# EAGLE design pcb_middle (EAGLE 9.6.2)
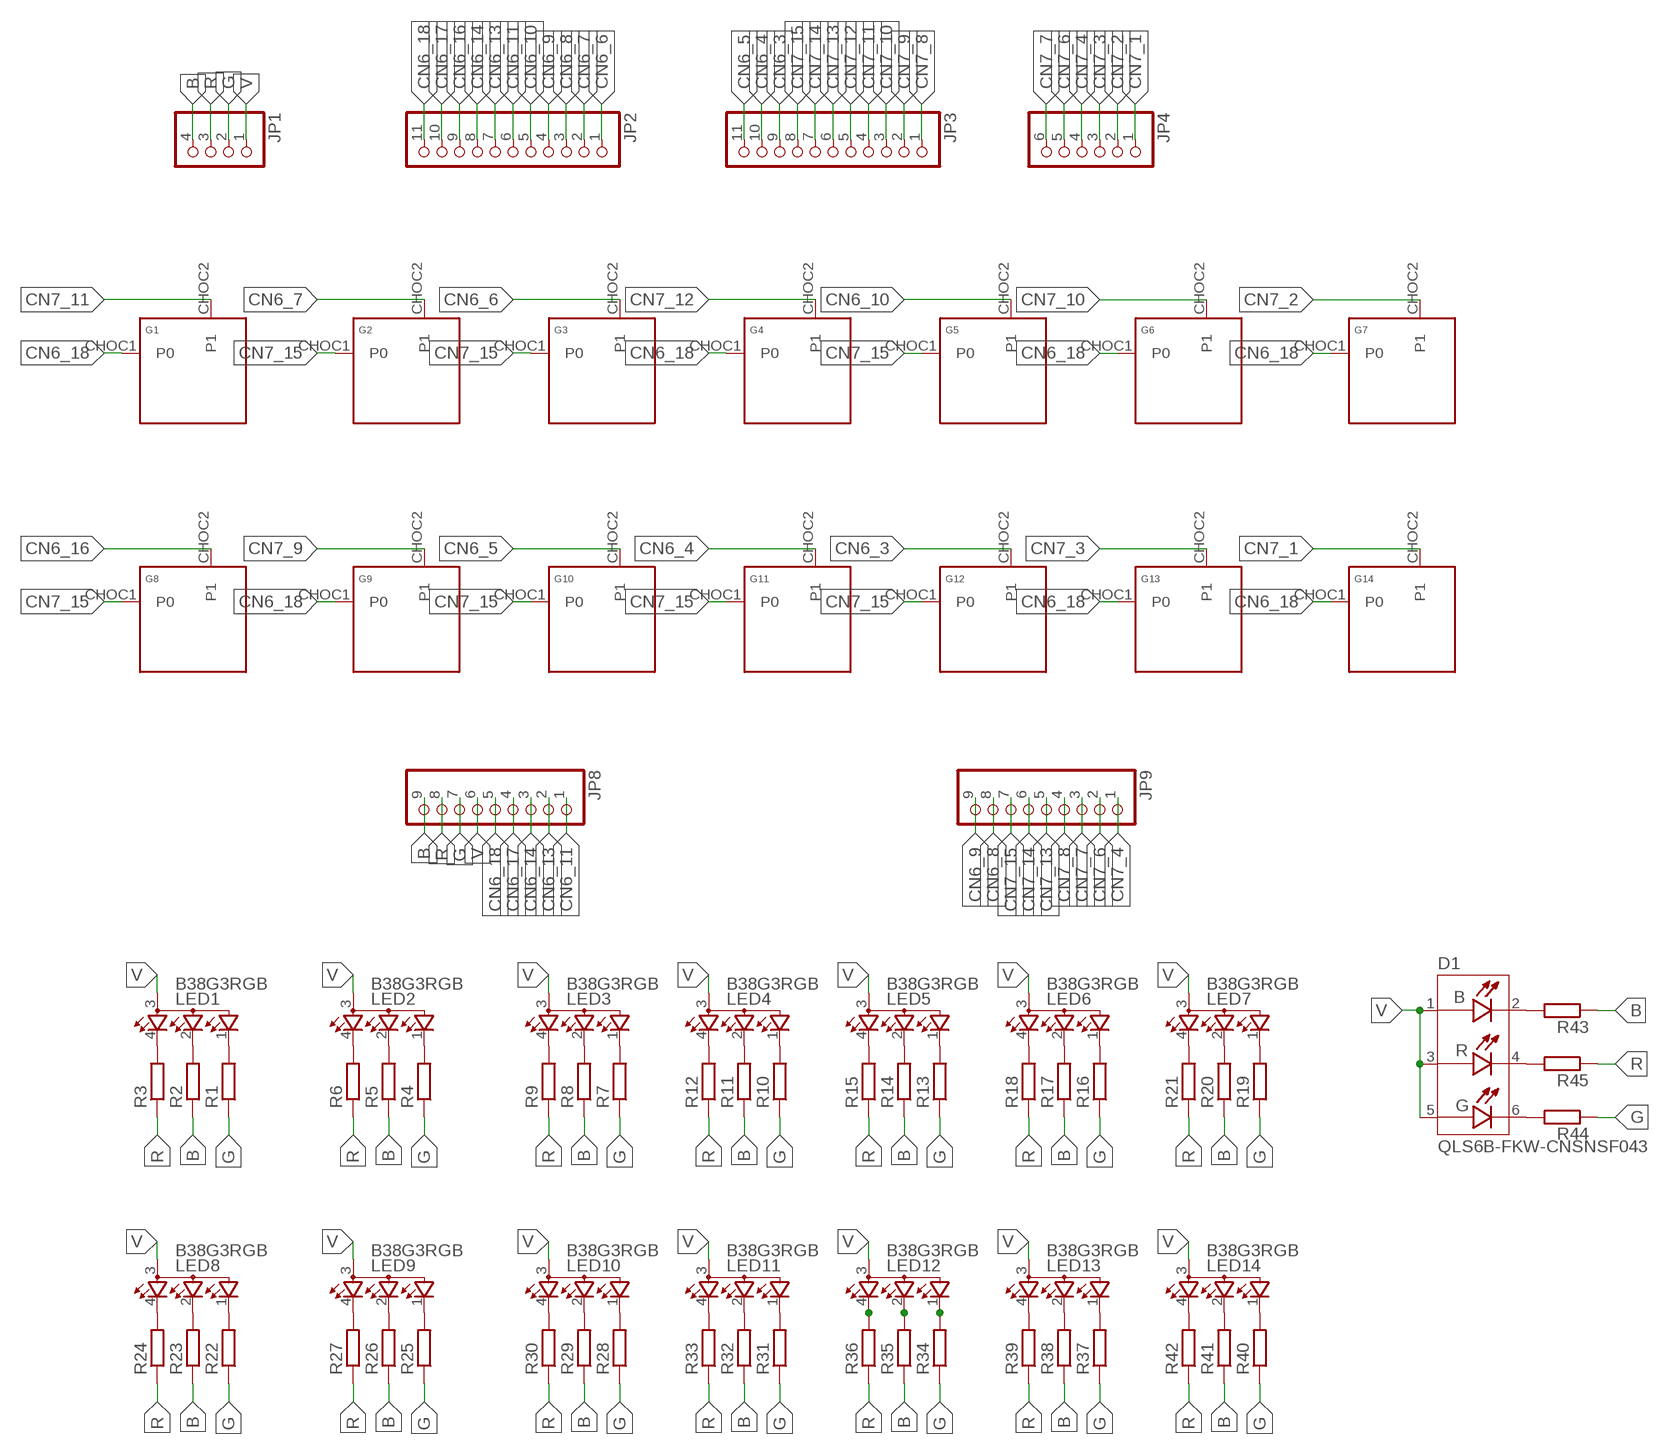
[diagram p0: schematic, sheet 1]

## Parts
D1  QLS6B-FKW-CNSNSF043  [LED_QLS6B-FKW-CNSNSF043]
G1  KEYSWITCH-PLAIN-CHOC-1U  [CHOC-1U]
G2  KEYSWITCH-PLAIN-CHOC-1U  [CHOC-1U]
G3  KEYSWITCH-PLAIN-CHOC-1U  [CHOC-1U]
G4  KEYSWITCH-PLAIN-CHOC-1U  [CHOC-1U]
G5  KEYSWITCH-PLAIN-CHOC-1U  [CHOC-1U]
G6  KEYSWITCH-PLAIN-CHOC-1U  [CHOC-1U]
G7  KEYSWITCH-PLAIN-CHOC-1U  [CHOC-1U]
G8  KEYSWITCH-PLAIN-CHOC-1U  [CHOC-1U]
G9  KEYSWITCH-PLAIN-CHOC-1U  [CHOC-1U]
G10  KEYSWITCH-PLAIN-CHOC-1U  [CHOC-1U]
G11  KEYSWITCH-PLAIN-CHOC-1U  [CHOC-1U]
G12  KEYSWITCH-PLAIN-CHOC-1U  [CHOC-1U]
G13  KEYSWITCH-PLAIN-CHOC-1U  [CHOC-1U]
G14  KEYSWITCH-PLAIN-CHOC-1U  [CHOC-1U]
JP1  THROUHOLE04  [THROUHOLE04]
JP2  THROUHOLE11  [THROUHOLE11]
JP3  THROUHOLE11  [THROUHOLE11]
JP4  THROUHOLE06  [THROUHOLE06]
JP8  THROUHOLE09  [THROUHOLE09]
JP9  THROUHOLE09  [THROUHOLE09]
LED1  B38G3RGB  [B38G3RGB]
LED2  B38G3RGB  [B38G3RGB]
LED3  B38G3RGB  [B38G3RGB]
LED4  B38G3RGB  [B38G3RGB]
LED5  B38G3RGB  [B38G3RGB]
LED6  B38G3RGB  [B38G3RGB]
LED7  B38G3RGB  [B38G3RGB]
LED8  B38G3RGB  [B38G3RGB]
LED9  B38G3RGB  [B38G3RGB]
LED10  B38G3RGB  [B38G3RGB]
LED11  B38G3RGB  [B38G3RGB]
LED12  B38G3RGB  [B38G3RGB]
LED13  B38G3RGB  [B38G3RGB]
LED14  B38G3RGB  [B38G3RGB]
R1  R-EU_R0603  [R0603]
R2  R-EU_R0603  [R0603]
R3  R-EU_R0603  [R0603]
R4  R-EU_R0603  [R0603]
R5  R-EU_R0603  [R0603]
R6  R-EU_R0603  [R0603]
R7  R-EU_R0603  [R0603]
R8  R-EU_R0603  [R0603]
R9  R-EU_R0603  [R0603]
R10  R-EU_R0603  [R0603]
R11  R-EU_R0603  [R0603]
R12  R-EU_R0603  [R0603]
R13  R-EU_R0603  [R0603]
R14  R-EU_R0603  [R0603]
R15  R-EU_R0603  [R0603]
R16  R-EU_R0603  [R0603]
R17  R-EU_R0603  [R0603]
R18  R-EU_R0603  [R0603]
R19  R-EU_R0603  [R0603]
R20  R-EU_R0603  [R0603]
R21  R-EU_R0603  [R0603]
R22  R-EU_R0603  [R0603]
R23  R-EU_R0603  [R0603]
R24  R-EU_R0603  [R0603]
R25  R-EU_R0603  [R0603]
R26  R-EU_R0603  [R0603]
R27  R-EU_R0603  [R0603]
R28  R-EU_R0603  [R0603]
R29  R-EU_R0603  [R0603]
R30  R-EU_R0603  [R0603]
R31  R-EU_R0603  [R0603]
R32  R-EU_R0603  [R0603]
R33  R-EU_R0603  [R0603]
R34  R-EU_R0603  [R0603]
R35  R-EU_R0603  [R0603]
R36  R-EU_R0603  [R0603]
R37  R-EU_R0603  [R0603]
R38  R-EU_R0603  [R0603]
R39  R-EU_R0603  [R0603]
R40  R-EU_R0603  [R0603]
R41  R-EU_R0603  [R0603]
R42  R-EU_R0603  [R0603]
R43  R-EU_R0603  [R0603]
R44  R-EU_R0603  [R0603]
R45  R-EU_R0603  [R0603]

## Nets
B: JP1.4 JP8.9 R2.1 R5.1 R8.1 R11.1 R14.1 R17.1 R20.1 R23.1 R26.1 R29.1 R32.1 R35.1 R38.1 R41.1 R43.1
CN6_3: G12.CHOC2(P1) JP3.9
CN6_4: G11.CHOC2(P1) JP3.10
CN6_5: G10.CHOC2(P1) JP3.11
CN6_6: G3.CHOC2(P1) JP2.1
CN6_7: G2.CHOC2(P1) JP2.2
CN6_8: JP2.3 JP9.8
CN6_9: JP2.4 JP9.9
CN6_10: G5.CHOC2(P1) JP2.5
CN6_11: JP2.6 JP8.1
CN6_13: JP2.7 JP8.2
CN6_14: JP2.8 JP8.3
CN6_16: G8.CHOC2(P1) JP2.9
CN6_17: JP2.10 JP8.4
CN6_18: G1.CHOC1(P0) G4.CHOC1(P0) G6.CHOC1(P0) G7.CHOC1(P0) G9.CHOC1(P0) G13.CHOC1(P0) G14.CHOC1(P0) JP2.11 JP8.5
CN7_1: G14.CHOC2(P1) JP4.1
CN7_2: G7.CHOC2(P1) JP4.2
CN7_3: G13.CHOC2(P1) JP4.3
CN7_4: JP4.4 JP9.1
CN7_6: JP4.5 JP9.2
CN7_7: JP4.6 JP9.3
CN7_8: JP3.1 JP9.4
CN7_9: G9.CHOC2(P1) JP3.2
CN7_10: G6.CHOC2(P1) JP3.3
CN7_11: G1.CHOC2(P1) JP3.4
CN7_12: G4.CHOC2(P1) JP3.5
CN7_13: JP3.6 JP9.5
CN7_14: JP3.7 JP9.6
CN7_15: G2.CHOC1(P0) G3.CHOC1(P0) G5.CHOC1(P0) G8.CHOC1(P0) G10.CHOC1(P0) G11.CHOC1(P0) G12.CHOC1(P0) JP3.8 JP9.7
G: JP1.2 JP8.7 R1.1 R4.1 R7.1 R10.1 R13.1 R16.1 R19.1 R22.1 R25.1 R28.1 R31.1 R34.1 R37.1 R40.1 R44.1
N$1: LED1.1(CGREEN) R1.2
N$2: LED1.2(CBLUE) R2.2
N$3: LED1.4(CRED) R3.2
N$4: LED2.1(CGREEN) R4.2
N$5: LED2.2(CBLUE) R5.2
N$6: LED2.4(CRED) R6.2
N$7: LED3.1(CGREEN) R7.2
N$8: LED3.2(CBLUE) R8.2
N$9: LED3.4(CRED) R9.2
N$10: LED4.1(CGREEN) R10.2
N$11: LED4.2(CBLUE) R11.2
N$12: LED4.4(CRED) R12.2
N$13: LED5.1(CGREEN) R13.2
N$14: LED5.2(CBLUE) R14.2
N$15: LED5.4(CRED) R15.2
N$16: LED6.1(CGREEN) R16.2
N$17: LED6.2(CBLUE) R17.2
N$18: LED6.4(CRED) R18.2
N$19: LED7.1(CGREEN) R19.2
N$20: LED7.2(CBLUE) R20.2
N$21: LED7.4(CRED) R21.2
N$22: LED8.1(CGREEN) R22.2
N$23: LED8.2(CBLUE) R23.2
N$24: LED8.4(CRED) R24.2
N$25: LED9.1(CGREEN) R25.2
N$26: LED9.2(CBLUE) R26.2
N$27: LED9.4(CRED) R27.2
N$28: LED10.1(CGREEN) R28.2
N$29: LED10.2(CBLUE) R29.2
N$30: LED10.4(CRED) R30.2
N$31: LED11.1(CGREEN) R31.2
N$32: LED11.2(CBLUE) R32.2
N$33: LED11.4(CRED) R33.2
N$34: LED12.1(CGREEN) R34.2
N$35: LED12.2(CBLUE) R35.2
N$36: LED12.4(CRED) R36.2
N$37: LED13.1(CGREEN) R37.2
N$38: LED13.2(CBLUE) R38.2
N$39: LED13.4(CRED) R39.2
N$40: LED14.1(CGREEN) R40.2
N$41: LED14.2(CBLUE) R41.2
N$42: LED14.4(CRED) R42.2
N$43: D1.2(BLUE_CATHODE) R43.2
N$44: D1.6(GREEN_CATHODE) R44.2
N$45: D1.4(RED_CATHODE) R45.2
R: JP1.3 JP8.8 R3.1 R6.1 R9.1 R12.1 R15.1 R18.1 R21.1 R24.1 R27.1 R30.1 R33.1 R36.1 R39.1 R42.1 R45.1
V: D1.1(BLUE_ANODE) D1.3(RED_ANODE) D1.5(GREEN_ANODE) JP1.1 JP8.6 LED1.3(A) LED2.3(A) LED3.3(A) LED4.3(A) LED5.3(A) LED6.3(A) LED7.3(A) LED8.3(A) LED9.3(A) LED10.3(A) LED11.3(A) LED12.3(A) LED13.3(A) LED14.3(A)

## Library data of the parts
D1 = QLS6B-FKW-CNSNSF043:QLS6B-FKW-CNSNSF043: Check prices <https://pricing.snapeda.com/parts/QLS6B-FKW-CNSNSF043/Cree%20Inc./view-part?ref=eda>; AVAILABILITY: In Stock; DESCRIPTION: Red, Green, Blue (RGB) 622nm Red, 530nm Green, 470nm Blue LED Indication - Discrete 2.1V Red, 3V Green, 3.1V Blue 6-SMD, J-Lead; MF: Cree Inc.; MP: QLS6B-FKW-CNSNSF043; PACKAGE: SMD-6 Cree; PRICE: None; PURCHASE-URL: https://pricing.snapeda.com/search/part/QLS6B-FKW-CNSNSF043/?ref=eda
G1-G14 = Keyboard:KEYSWITCH-PLAIN
JP1 = pinhead-half-pitch:THROUHOLE04
JP2 JP3 = pinhead-half-pitch:THROUHOLE11
JP4 = pinhead-half-pitch:THROUHOLE06
JP8 JP9 = pinhead-half-pitch:THROUHOLE09
LED1-LED14 = led_rgb:B38G3RGB: Chip LED RGB Source: http://document.sharpsma.com/files/GM1WA55311A_SS.pdf
R1-R45 = rcl:R-EU_: RESISTOR, European symbol; SPICEPREFIX: R

## Board
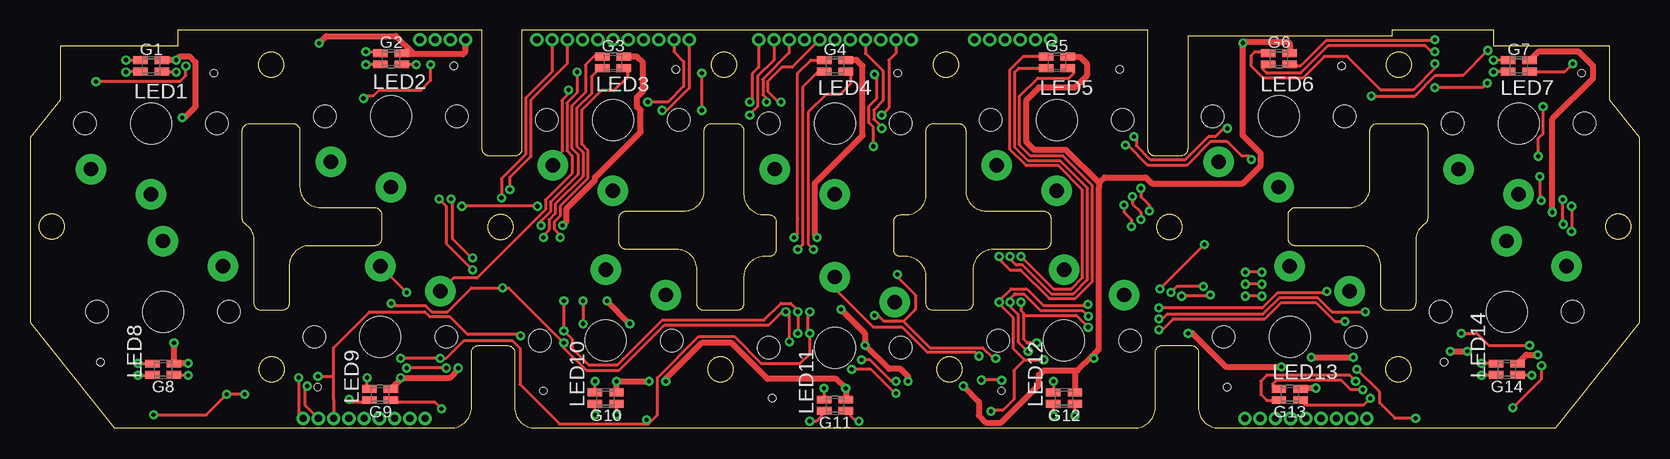
[diagram p1: board, top side]
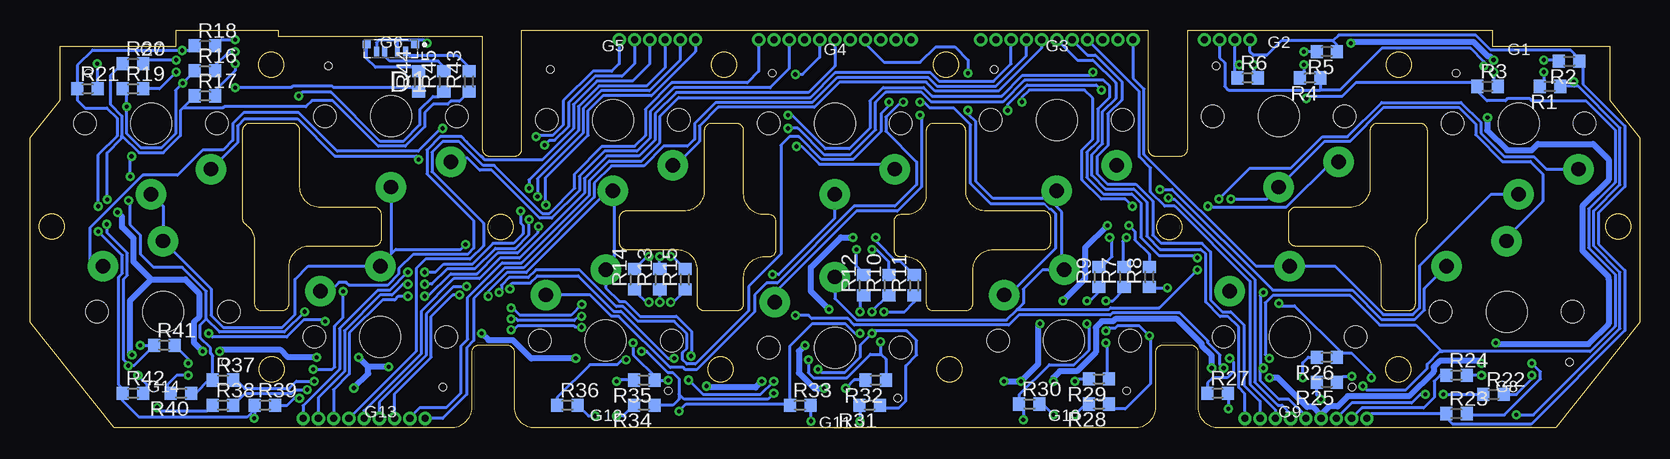
[diagram p2: board, bottom side, seen from below]

Size 134.2 x 33.2 mm. Coordinates in mm from the lower left corner, seen from the top.
Outline: 49.11,17.5 arc-90 49.71,18.1 54.5,18.1 arc90 56.2,19.8 56.2,24.8 arc-90 56.8,25.4 58.9,25.4 arc-90 59.5,24.8 59.5,19.5 arc90 61.2,17.8 61.6,17.8 arc-90 62.2,17.2 62.2,14.9 arc-90 61.6,14.3 61.2,14.3 arc90 59.5,12.6 59.5,10.4 arc-90 58.9,9.8 56.2,9.8 arc-90 55.6,10.4 55.6,13.2 arc90 53.9,14.9 49.71,14.9 arc-90 49.11,15.5 49.11,17.5
Outline: 80.3,14.9 arc90 78.6,13.2 78.6,10.4 arc-90 78,9.8 75.3,9.8 arc-90 74.7,10.4 74.7,12.6 arc90 73,14.3 72.6,14.3 arc-90 72,14.9 72,17.2 arc-90 72.6,17.8 73,17.8 arc90 74.7,19.5 74.7,24.8 arc-90 75.3,25.4 77.4,25.4 arc-90 78,24.8 78,19.8 arc90 79.7,18.1 84.49,18.1 arc-90 85.09,17.5 85.09,15.5 arc-90 84.49,14.9 80.3,14.9
Outline: 17.7,24.8 arc-90 18.3,25.4 21.9,25.4 arc-90 22.5,24.8 22.5,20.1 arc90 24.2,18.4 28.71,18.4 arc-90 29.31,17.8 29.31,15.8 arc-90 28.71,15.2 23.3,15.2 arc90 21.6,13.5 21.6,10.4 arc-90 21,9.8 19.3,9.8 arc-90 18.7,10.4 18.7,15.6 arc56 17.96,17 arc-56 17.7,17.5 17.7,24.8
Outline: 116.5,17.5 arc-56 116.24,17 arc56 115.5,15.6 115.5,10.4 arc-90 114.9,9.8 113.2,9.8 arc-90 112.6,10.4 112.6,13.5 arc90 110.9,15.2 105.49,15.2 arc-90 104.89,15.8 104.89,17.8 arc-90 105.49,18.4 110,18.4 arc90 111.7,20.1 111.7,24.8 arc-90 112.3,25.4 115.9,25.4 arc-90 116.5,24.8 116.5,17.5
Outline: 134.2,8.83 134.2,24.21 131.7,27.36 131.7,31.85 122,31.85 122,33.2 113.5,33.2 113.5,32.7 96.5,32.7 96.5,23.29 arc-90 95.9,22.69 93.8,22.69 arc-90 93.2,23.29 93.2,33.2 41,33.2 41,23.29 arc-90 40.4,22.69 38.3,22.69 arc-90 37.7,23.29 37.7,33.2 12.3,33.2 12.3,31.85 2.5,31.85 2.5,27.36 0,24.21 0,8.83 7.02,0 35.1,0 arc90 36.8,1.7 36.8,6.29 arc-90 37.4,6.89 39.8,6.89 arc-90 40.4,6.29 40.4,1.7 arc90 42.1,0 92.1,0 arc90 93.8,1.7 93.8,6.29 arc-90 94.4,6.89 96.8,6.89 arc-90 97.4,6.29 97.4,1.7 arc90 99.1,0 127.18,0 134.2,8.83
Outline: circle at 1.8,16.81 radius 1.05
Outline: circle at 20.1,30.3 radius 1.05
Outline: circle at 20.15,4.9 radius 1.05
Outline: circle at 39.21,16.79 radius 1.05
Outline: circle at 57.85,30.3 radius 1.05
Outline: circle at 57.55,4.9 radius 1.05
Outline: circle at 76.65,4.9 radius 1.05
Outline: circle at 76.35,30.3 radius 1.05
Outline: circle at 94.99,16.79 radius 1.05
Outline: circle at 114.05,4.9 radius 1.05
Outline: circle at 114.1,30.3 radius 1.05
Outline: circle at 132.4,16.81 radius 1.05
Copper layers (1*16): Top 0.035mm / dielectric 1.5mm / Bottom 0.035mm
Design rules "PCBGoGo": minimum track width 6mil, minimum drill 0.2mm, track to track 6mil, track to pad 6mil, pad to pad 6mil, via to via 6mil, smd to smd 6mil, copper to edge 0.2mm, drill to drill 6mil, minimum pad ring 10mil, minimum via ring 8mil, stop-mask expansion 4mil, vias tented up to drill 0mil, thermal gap 10mil

### Footprints (pad centres in the part's own frame; a part is rotated, then mirrored left to right if it is on the bottom)
LED_QLS6B-FKW-CNSNSF043 = smd 0.66 x 0.63: 1 -2.02,-0.185; 6 2.02,-0.185 | smd 0.4 x 0.8: 2 -1.21,0.4; 3 -0.53,0.4; 4 0.53,0.4; 5 1.21,0.4
CHOC-1U = drill 1.2 pad 2.54: CHOC1 0,5.9; CHOC2 5,3.8 | hole 3.4: 0,0 | hole 0.6: -5.22,-4.2 | hole 1.85: -5.5,0; 5.5,0
THROUHOLE04 = drill 0.6: 1 -1.905,0; 2 -0.635,0; 3 0.635,0; 4 1.905,0
THROUHOLE11 = drill 0.6: 1 -6.35,0; 2 -5.08,0; 3 -3.81,0; 4 -2.54,0; 5 -1.27,0; 6 0,0; 7 1.27,0; 8 2.54,0; 9 3.81,0; 10 5.08,0; 11 6.35,0
THROUHOLE06 = drill 0.6: 1 -3.175,0; 2 -1.905,0; 3 -0.635,0; 4 0.635,0; 5 1.905,0; 6 3.175,0
THROUHOLE09 = drill 0.6: 1 -5.08,0; 2 -3.81,0; 3 -2.54,0; 4 -1.27,0; 5 0,0; 6 1.27,0; 7 2.54,0; 8 3.81,0; 9 5.08,0
B38G3RGB = smd 0.65 x 1.2: 1 -0.475,0.9; 2 0.475,0.9; 3 0.475,-0.9; 4 -0.475,-0.9
R0603 = smd 1 x 1.1: 1 -0.85,0; 2 0.85,0

### Placement (x,y rotation side)
D1  104.1,31.8 180 bottom
G1  10.1,25.4 180 top
G2  30.1,26 180 top
G3  48.6,25.7 180 top
G4  67.1,25.4 180 top
G5  85.6,25.7 180 top
G6  104.1,26 180 top
G7  124.1,25.4 180 top
G8  11.1,9.7 0 top
G9  29.2,7.6 0 top
G10  48,7.3 0 top
G11  67.1,6.7 0 top
G12  86.2,7.3 0 top
G13  105,7.6 0 top
G14  123.1,9.7 0 top
JP1  34.4,32.4 180 top
JP2  48.6,32.4 180 top
JP3  67.1,32.4 180 top
JP4  81.9,32.4 180 top
JP8  27.85,0.8 180 top
JP9  106.35,0.8 180 top
LED1  10.1,30.2 90 top
LED2  30.1,30.8 90 top
LED3  48.6,30.5 90 top
LED4  67.1,30.2 90 top
LED5  85.6,30.5 90 top
LED6  104.1,30.8 90 top
LED7  124.1,30.2 90 top
LED8  11.1,4.9 90 top
LED9  29.2,2.8 90 top
LED10  48,2.5 90 top
LED11  67.1,1.9 90 top
LED12  86.2,2.5 90 top
LED13  105,2.8 90 top
LED14  123.1,4.9 90 top
R1  7.5,28.5 180 bottom
R2  5.9,30.6 180 bottom
R3  12.7,28.5 0 bottom
R4  27.5,29.2 180 bottom
R5  26.1,31.4 180 bottom
R6  32.7,29.2 0 bottom
R7  43,12.6 90 bottom
R8  40.9,12.6 90 bottom
R9  45.1,12.6 90 bottom
R10  62.6,11.9 90 bottom
R11  60.5,11.9 90 bottom
R12  64.7,11.9 90 bottom
R13  81.7,12.4 90 bottom
R14  83.8,12.4 90 bottom
R15  79.6,12.4 90 bottom
R16  119.6,29.8 0 bottom
R17  119.6,27.7 0 bottom
R18  119.6,31.9 0 bottom
R19  125.6,28.3 0 bottom
R20  125.6,30.4 0 bottom
R21  129.4,28.3 0 bottom
R22  12.2,2.8 0 bottom
R23  15.3,1.2 0 bottom
R24  15.3,4.4 0 bottom
R25  26.1,3.8 180 bottom
R26  26.1,5.9 180 bottom
R27  35.2,2.9 0 bottom
R28  45.1,2 180 bottom
R29  45.1,4.1 180 bottom
R30  50.9,2 0 bottom
R31  64.2,1.9 180 bottom
R32  63.7,4 180 bottom
R33  70,1.9 0 bottom
R34  83,1.9 180 bottom
R35  83,4 180 bottom
R36  89.4,1.9 0 bottom
R37  118.1,4 0 bottom
R38  118.1,1.9 0 bottom
R39  114.6,1.9 0 bottom
R40  121.6,2.9 180 bottom
R41  123,6.9 0 bottom
R42  125.6,2.9 0 bottom
R43  97.6,28.9 90 bottom
R44  101.8,28.9 90 bottom
R45  99.7,28.9 90 bottom

### Tracks (layer width: path | path; a pad name or v marks a point on that pad's centre or on a via)
B  (via drill 0.35)
  Top 0.254: v22.4,4.2 22.4,1.17 JP8.9 | v30.1,10.4 30.3,10.2 33,10.2 33.49,9.71 34.81,9.71 36.8,11.7 v39.4,11.7 39.9,11.7 v44.5,7.1 44.5,6.7 46.4,4.8 49.1,4.8 52.91,8.61 58.44,8.61 58.45,8.6 61.6,8.6 62.7,9.7 v63,9.7 63.3,9.4 v63.3,7.2 | v82.61,10.5 82.61,9.81 82.8,9.62 82.8,9.4 | v83.92,7.1 83.14,7.1 82.8,7.44 82.8,9.4 | v81,3.98 80.98,4 v79.3,4 | v72.2,3.9 71.8,3.9 70.01,5.69 v69.31,5.69 | v123.6,1.7 126,4.1 v126,5.2 | 82.8,9.4 87.22,9.4 v88.21,8.41 | v94.1,8.2 94.4,8.2 95.3,9.11 102.95,9.11 104.32,10.48 107.17,10.48 108.75,8.9 v109.6,8.9 | v127.8,17 127.77,17.03 v127.77,19.06 | v119.3,7.9 120.6,7.9 121.6,6.9 v125,6.9
  Bottom 0.254: JP8.9 22.37,1.2 16.2,1.2 | R23.1 16.2,1.2 | 16.2,1.2 16.2,0.93 15.6,0.33 9.07,0.33 1.25,8.14 1.25,13.16 3.45,15.36 3.45,17.94 1.25,20.14 1.25,25.2 4.75,28.7 4.75,30.3 R2.1 5.05,30.8 5.77,31.52 12.44,31.52 13.7,32.78 25.12,32.78 25.6,32.3 | v22.4,4.2 22.4,4.6 24.05,6.25 24.85,6.25 | R8.1 40.85,11.7 v39.4,11.7 | v44.5,7.1 44.45,7.05 44.45,4.3 R29.1 | v30.1,10.4 29.9,10.2 28.8,10.2 24.85,6.25 | R26.1 24.9,6.25 24.85,6.25 | 25.6,32.3 29.9,32.3 31.1,31.1 32.2,31.1 32.5,31.4 JP1.4 | R5.1 25.22,31.43 25.22,31.93 25.6,32.3 | v63.3,7.2 63.3,6.2 63.25,6.15 | 63.25,6.15 62.85,5.75 R32.1 | v63,9.7 61.3,9.7 60.5,10.5 R11.1 | R14.1 83.8,11.45 82.73,10.38 v82.61,10.5 | v83.92,7.1 83.92,6.12 81.97,4.18 R35.1 82.13,3.98 v81,3.98 | v69.31,5.69 69.31,4.61 68.9,4.2 66.1,4.2 64.15,6.15 63.25,6.15 | v79.3,4 78.11,2.81 73.29,2.81 v72.2,3.9 | R38.1 119.45,1.4 123.3,1.4 v123.6,1.7 | v88.21,8.41 88.71,8.41 88.85,8.55 93.52,8.55 93.87,8.2 v94.1,8.2 | R17.1 121.42,26.73 | 121.42,26.73 121.67,26.48 121.67,24.39 123.09,22.97 125.11,22.97 126.53,24.39 | R20.1 126.5,30.4 127.5,29.4 127.5,27 126.53,26.03 126.53,24.39 | v127.8,17 127.8,16.3 126.09,14.59 126.09,12.73 126.39,12.43 126.39,5.69 126,5.3 v126,5.2 125.55,5.2 R41.1 v125,6.9 | v127.77,19.06 127.77,22.95 126.53,24.19 126.53,24.39 | 121.42,26.73 121.4,26.7 118.1,26.7 118,26.8 111.2,26.8 110.69,27.31 108.99,27.31 105.17,23.5 102.92,23.5 | v109.6,8.9 109.7,9 111.4,9 112.8,7.6 119,7.6 v119.3,7.9 | R43.1 98.4,27.25 99.12,27.25 99.37,27 100.59,27 101.29,26.3 101.29,25.13 102.92,23.5 | 102.9,23.5 102.92,23.5
CN6_3  (via drill 0.35)
  Top 0.254: v61.4,27.2 61.4,27.51 61.09,27.81 61.09,29.1 63.29,31.3 JP3.9
  Bottom 0.254: v61.4,27.2 61.6,27.2 62.85,25.95 62.85,24.75 60.3,22.2 60.3,20.3 62.1,18.5 65.5,18.5 71.9,12.1 72.8,12.1 73.8,11.1 73.8,9.7 78.62,4.87 79.59,4.87 79.76,5.04 80.84,5.04 85.13,9.33 85.73,9.33 87.5,11.1 G12.CHOC2
CN6_4  (via drill 0.35)
  Top 0.254: v60,26.1 60,26.17 60.66,26.83 60.66,29.34 62.02,30.7 JP3.10
  Bottom 0.254: G11.CHOC2 72.1,11.3 65.31,18.09 61.91,18.09 59.89,20.11 59.89,25.99 v60,26.1
CN6_5  (via drill 0.35)
  Top 0.254: JP3.11 60.75,30.1 60.2,29.55 60.2,27.4 v60,27.2
  Bottom 0.203: 49.7,18.7 49.65,18.7 49.23,18.28 49.1,18.28 49.08,18.25
  Bottom 0.254: G10.CHOC2 52.7,11.4 52.3,11.4 48.7,15 48.7,17.88 49.08,18.25 | v60,27.2 59.7,27.2 59.2,26.7 57.2,26.7 55.8,25.3 55.8,20.4 54.1,18.7 49.7,18.7
CN6_6  (via drill 0.35)
  Top 0.254: JP2.1 54.95,28.35 53.1,26.5 v52.7,26.5 | G3.CHOC2 43.6,22.3 44.35,23.05 44.35,27.35 44.8,27.8 44.8,28.1 v44.9,28.2
  Bottom 0.254: v52.7,26.5 52.7,27 51.09,28.61 45.31,28.61 v44.9,28.2
CN6_7  (via drill 0.35)
  Top 0.254: v42.3,18.5 v36,18.5 | JP2.2 53.68,31.4 54.5,30.58 54.5,28.5 53.2,27.2 v51.5,27.2
  Bottom 0.254: G2.CHOC2 25.7,22.2 29.5,18.4 35.9,18.4 v36,18.5 | v51.5,27.2 51.5,27.6 50.9,28.2 46.3,28.2 45.6,27.5 45.6,24.1 46.51,23.19 46.51,20.71 44.9,19.1 42.9,19.1 v42.3,18.5
CN6_8
  Bottom 0.254: JP2.3 52.41,30.39 53.88,28.92 58.42,28.92 59.17,29.67 67.05,29.67 69.14,27.58 80.12,27.58 81.68,26.02 81.68,23.82 83.22,22.28 85.92,22.28 87.57,20.63 87.57,19.43 93.23,13.77 94.83,13.77 97.7,10.9 97.7,7.4 98.3,6.8 98.3,2.9 99.5,1.7 101.7,1.7 102.54,0.86 JP9.8
CN6_9
  Bottom 0.254: JP2.4 51.14,31.06 53.69,28.51 58.59,28.51 59.34,29.26 66.89,29.26 68.98,27.17 77.03,27.17 78.8,25.4 78.8,24.1 79.4,23.5 81.4,23.5 83.03,21.87 85.73,21.87 87.17,20.43 87.17,19.26 93.06,13.37 94.63,13.37 97.2,10.8 97.2,7.3 97.8,6.7 97.8,2.8 99.8,0.8 JP9.9
CN6_10
  Bottom 0.254: JP2.5 49.87,31.7 53.46,28.11 58.75,28.11 59.5,28.86 66.72,28.86 68.81,26.77 76.83,26.77 78.39,25.21 78.39,23.91 80.4,21.9 G5.CHOC2
CN6_11
  Bottom 0.254: JP8.1 32.93,2.86 33.45,3.38 33.45,8.42 34.33,9.3 35,9.3 36.2,10.5 36.2,14.5 36.6,14.9 40,14.9 41.1,16 41.1,18.85 42.19,19.94 44.54,19.94 45.69,21.09 45.69,22.81 44.79,23.71 44.79,26.4 43.7,27.49 43.7,28.8 45.6,30.7 46.9,30.7 JP2.6
CN6_13
  Bottom 0.254: JP8.2 31.66,2.24 33,3.58 33,8.6 34.11,9.71 34.81,9.71 35.79,10.69 35.79,14.69 36.5,15.4 39.9,15.4 40.6,16.1 40.6,18.92 42.03,20.35 44.38,20.35 45.25,21.22 45.25,22.65 44.35,23.55 44.35,26.22 43.2,27.37 43.2,28.9 45.41,31.11 46.04,31.11 JP2.7
CN6_14
  Bottom 0.254: JP8.3 30.39,1.54 32.51,3.66 32.51,12.23 38.77,18.5 39.6,18.5 40.8,19.7 40.8,21.7 41.73,22.63 41.73,28.07 JP2.8
CN6_16  (via drill 0.35)
  Top 0.254: v40,19.9 40,20.9 41.73,22.63 41.73,27.34 44.79,30.4 JP2.9
  Bottom 0.254: v40,19.9 39,19.9 30.6,11.5 23.99,11.5 21.56,9.07 18.74,9.07 17.97,9.84 17.97,11.63 G8.CHOC2
CN6_17  (via drill 0.35)
  Top 0.254: JP2.10 43.52,29.72 41.33,27.53 41.33,22.83 39.3,20.8 v39.3,19.2
  Bottom 0.254: v39.3,19.2 39.2,19.1 38.8,19.1 32.1,12.4 32.1,3.82 30.18,1.9 29.82,1.9 29.12,1.2 JP8.4
CN6_18  (via drill 0.35)
  Top 0.254: v72.3,12.8 72.3,12.6 73.8,11.1 73.8,9.9 72.8,8.9 | v31.4,11.3 G9.CHOC1 | v70.4,9.4 70.7,9.4 71.2,8.9 72.8,8.9 | v97.9,15.3 v94.2,11.6 | v34.7,5 v31.4,5 | 72.8,8.9 75,6.7 79.4,6.7 80.3,5.8 v80.5,5.8
  Bottom 0.254: JP2.11 42.25,29.2 41.33,28.28 41.33,22.83 32,13.5 G9.CHOC1 25.42,13.5 21.39,9.47 18.91,9.47 18.37,10.01 18.37,13.53 12.4,19.5 G1.CHOC1 | G7.CHOC1 123.1,18.5 G14.CHOC1 119.1,11.6 119.1,9.4 118.11,8.41 113.16,8.41 112.1,9.48 112.1,12.4 111,13.5 105.1,13.5 | 105.1,13.5 G13.CHOC1 105,13.6 103.7,14.9 98.3,14.9 v97.9,15.3 | G6.CHOC1 104.1,14.5 105.1,13.5 | v72.3,12.8 71.8,12.8 67.1,17.5 G4.CHOC1 | v94.2,11.6 94.2,11.9 94,12.1 92.5,12.1 91.9,12.7 88.5,12.7 85.53,9.73 84.93,9.73 81,5.8 v80.5,5.8 | v34.7,5 35,5.3 35,6.1 36,7.1 36,7.25 38.36,9.62 43.96,9.62 44.15,9.43 51.77,9.43 52.61,8.59 65.49,8.59 66.03,9.13 69.03,9.13 69.3,9.4 v70.4,9.4 | 31.66,5.06 31.66,11.04 v31.4,11.3 | 31.66,5.06 31.6,5 v31.4,5 | JP8.5 27.85,1 29.24,2.39 30.09,2.39 31.66,3.96 31.66,5.06
CN7_1  (via drill 0.35)
  Top 0.254: v92.02,24.3 92.22,24.1 92.22,23.55 93.41,22.36 96.29,22.36 98.23,24.3 98.8,24.3 99.5,25 v99.8,25
  Bottom 0.254: JP4.1 85.07,30.38 85.7,29.76 87.28,29.76 89.75,27.29 89.75,25.28 90.62,24.41 91.91,24.41 v92.02,24.3 | v99.8,25 99.92,25 101.83,23.09 108.59,23.09 111.8,26.3 116.4,26.3 117.3,25.4 117.3,24 118.1,23.2 119.8,23.2 121.9,21.1 124.8,21.1 129.2,16.7 129.2,13.6 129.1,13.5 G14.CHOC2
CN7_2  (via drill 0.35)
  Top 0.254: v91.3,23.6 91.5,23.6 93.19,21.91 96.43,21.91 98.41,23.89 99.81,23.89 101,22.7 101.6,22.7 101.8,22.5 v101.8,22.4
  Bottom 0.254: JP4.2 83.8,30.4 84.85,29.35 87.11,29.35 89.3,27.17 89.3,25.15 90.45,24 90.9,24 v91.3,23.6 | v101.8,22.4 101.8,22.5 101.99,22.69 108.79,22.69 111.9,25.8 116.3,25.8 116.89,25.21 116.89,23.81 G7.CHOC2
CN7_3
  Bottom 0.254: JP4.3 82.53,30.37 83.95,28.95 86.94,28.95 88.89,27 88.89,24.98 91.51,22.36 96.29,22.36 96.55,22.63 96.56,22.63 96.56,22.64 96.63,22.71 97.79,23.87 98.22,24.3 100,24.3 101.1,23.2 101.1,21.2 97.2,17.3 97.2,15 97.71,14.49 102.26,14.49 103.45,13.3 103.45,12.86 104.4,11.91 104.4,11.9 107.57,11.9 107.83,12.16 108.44,12.16 109.2,11.4 G13.CHOC2
CN7_4  (via drill 0.35)
  Top 0.254: v102.7,13 v101.3,13 | v92.6,20 92.6,19.3 93.3,18.6 v93.3,18.1
  Bottom 0.254: v101.3,13 100.4,13 99.72,13.68 97.32,13.68 95.6,15.4 93.9,15.4 93.1,16.2 93.1,16.9 93.3,17.1 v93.3,18.1 | JP9.1 111.43,1.87 108.39,4.91 108.39,8.31 105.21,11.49 104.21,11.49 v102.7,13 | JP4.4 81.26,30.06 82.78,28.54 86.78,28.54 88.49,26.83 88.49,24.81 92.6,20.7 v92.6,20
CN7_6  (via drill 0.35)
  Top 0.254: v102.7,12 v101.3,12 | v91.9,19.3 91.9,18.7 92.6,18 v92.6,17.4
  Bottom 0.254: JP4.5 79.99,30.71 82.57,28.13 86.61,28.13 88.08,26.66 88.08,24.62 91.9,20.8 v91.9,19.3 | JP9.2 110.16,2.54 107.99,4.71 107.99,8.11 105.01,11.09 104.01,11.09 103.1,12 v102.7,12 | v101.3,12 100.7,12 99.43,13.27 97.13,13.27 95.41,14.99 93.73,14.99 92.6,16.13 v92.6,17.4
CN7_7  (via drill 0.35)
  Top 0.254: v102.7,11 v101.3,11 | v91.2,18.6 91.2,18 91.8,17.4 v91.8,16.8
  Bottom 0.254: JP4.6 78.72,31.4 82.4,27.73 86.44,27.73 87.67,26.49 87.67,24.43 91.2,20.9 v91.2,18.6 | JP9.3 108.89,3.2 107.58,4.51 107.58,7.92 104.82,10.68 103.82,10.68 103.5,11 v102.7,11 | v101.3,11 101,11 99.13,12.87 96.93,12.87 95.21,14.59 93.56,14.59 91.9,16.25 91.9,16.7 v91.8,16.8
CN7_8
  Bottom 0.254: JP3.1 73.45,29.75 74.4,28.8 80.7,28.8 82.9,26.6 82.9,24.4 83.8,23.5 86.5,23.5 88.8,21.2 88.8,20 90.89,17.91 91.51,17.91 95.51,21.91 96.43,21.91 98.41,23.89 99.81,23.89 100.69,23.01 100.69,21.39 96.4,17.1 96.4,15.2 97.51,14.09 101.24,14.09 102,13.33 102,6.4 107.6,0.8 JP9.4
CN7_9  (via drill 0.35)
  Top 0.254: JP3.2 72.18,31.28 71.6,30.7 71.6,26.7 v71,26.1 | v45.6,29.7 45.6,27.97 44.76,27.13 44.76,23.14 45.2,22.7 45.2,21.25 42.97,19.02 42.97,18.22 37.25,12.5 35.3,12.5 G9.CHOC2
  Bottom 0.254: v45.6,29.7 45.88,29.42 51.48,29.42 53.2,27.7 58.99,27.7 59.7,28.41 63.09,28.41 64.2,27.3 64.2,25 65.9,23.3 67.9,23.3 70.7,26.1 v71,26.1
CN7_10
  Bottom 0.254: JP3.3 70.91,29.99 72.51,28.39 80.51,28.39 82.49,26.41 82.49,24.21 83.61,23.09 86.31,23.09 88.39,21.01 88.39,19.81 90.7,17.5 91.7,17.5 95.7,21.5 96.7,21.5 97.7,22.5 98.8,22.5 G6.CHOC2
CN7_11  (via drill 0.35)
  Top 0.254: JP3.4 69.64,31.26 71.1,29.8 71.1,27.3 70.34,26.54 70.34,25.76 71,25.1 v71,25 | v35.1,19.1 35.2,19 35.2,15.8 36.8,14.2 v36.9,14.2
  Bottom 0.254: v36.9,14.2 37.1,14.4 40.1,14.4 41.6,15.9 41.6,18.78 42.36,19.54 44.74,19.54 46.1,20.9 46.1,23 45.19,23.91 45.19,26.61 44.2,27.6 44.2,28.5 44.71,29.01 51.29,29.01 53.1,27.2 59.07,27.2 59.87,28 62.87,28 63.71,27.17 63.71,24.89 65.79,22.81 68.01,22.81 70.2,25 v71,25 | v35.1,19.1 32.53,21.67 29.1,21.67 26.47,24.31 24.37,24.31 21.52,27.16 14.91,27.16 13.26,25.51 13.26,24.61 11.29,22.64 8.84,22.64 7.8,21.6 G1.CHOC2
CN7_12  (via drill 0.35)
  Top 0.254: v70.4,29.5 70.6,29.3 70.6,27.5 69.93,26.83 69.93,25.47 70.3,25.1 v70.3,23.5
  Bottom 0.254: JP3.5 68.37,30.93 69.8,29.5 v70.4,29.5 | v70.3,23.5 69.9,23.5 68.4,22 62.5,22 G4.CHOC2
CN7_13
  Bottom 0.254: JP9.5 106.35,1.45 101.59,6.21 101.59,9.74 98.87,12.46 96.74,12.46 95.02,14.18 93.39,14.18 87.98,19.6 87.98,20.82 86.11,22.69 83.44,22.69 82.09,24.04 82.09,26.21 80.31,27.99 69.31,27.99 67.1,30.2 JP3.6
CN7_14  (via drill 0.35)
  Top 0.254: JP3.7 63.53,30.1 62.7,30.1 61.5,28.9 61.5,28.1 62.4,27.2 v62.6,27.2 | v97.8,11.8 95.6,11.8 v95.1,11.3
  Bottom 0.254: v95.1,11.3 94.9,11.5 94.9,11.9 94.24,12.56 92.67,12.56 92.02,13.2 88.4,13.2 85.34,10.14 84.76,10.14 83.53,8.91 80.51,8.91 79.45,7.85 79.45,6.65 79.8,6.3 79.8,5.7 79.44,5.34 78.73,5.34 74.3,9.77 74.3,11.8 71.6,14.5 71.6,23.6 70.9,24.3 70.1,24.3 68.21,22.41 65.59,22.41 63.26,24.74 63.26,26.24 62.6,26.9 v62.6,27.2 | v97.8,11.8 v97.81,11.81 98.87,11.81 101.16,9.52 101.16,6.07 105.08,2.15 JP9.6
CN7_15  (via drill 0.35)
  Top 0.254: v98.4,11.1 98.3,11 v96,11 | v34.1,19.1 34.7,18.5 34.7,15.4 v36.9,13.2 | G11.CHOC1 67.1,11.6 70.3,8.4 72.72,8.4 74.83,6.29 78.81,6.29 v79.1,6 | v56,29.6 v56,26.5
  Bottom 0.254: JP3.8 64.56,32.06 63,30.5 60,30.5 58.7,31.8 57.1,31.8 56,30.7 v56,29.6 | v96,11 96,11.4 94.44,12.96 92.84,12.96 86,19.8 G5.CHOC1 85.6,18.9 85.5,18.8 85.5,13.9 G12.CHOC1 86.2,11.69 85.05,10.55 84.6,10.55 83.36,9.31 80.31,9.31 79.04,8.04 79.04,6.06 v79.1,6 | JP9.7 103.81,2.84 100.75,5.9 100.75,9.32 98.97,11.1 v98.4,11.1 | G8.CHOC1 11.1,15.9 8.1,18.9 8.1,21.2 9.13,22.23 11.46,22.23 13.7,24.47 13.7,25.37 15.08,26.75 21.35,26.75 24.2,23.9 26.3,23.9 G2.CHOC1 31.1,19.1 v34.1,19.1 | v36.9,13.2 40.07,10.03 44.13,10.03 44.25,9.9 51.9,9.9 | v56,26.5 56,26.2 55.35,25.55 55.35,20.58 53.92,19.15 49.35,19.15 | 49.35,19.15 49.25,19.15 G3.CHOC1 | G11.CHOC1 67.1,10.8 65.3,9 52.8,9 51.9,9.9 | 51.9,9.9 51.4,10.4 51.4,11.6 49.8,13.2 G10.CHOC1 48.2,13.4 48.2,18 49.35,19.15
G  (via drill 0.35)
  Top 0.254: v17.9,2.8 v16.4,2.8 14.7,1.1 v10.3,1.1 | v5.5,28.9 12.5,28.9 13,29.4 v13,30.2 | JP8.7 25.31,2.39 25.3,2.4 25.3,4.3 | v44.5,10.6 v44.5,8.1 45.17,7.43 45.17,6.66 46.56,5.27 48.97,5.27 52.72,9.02 58.6,9.02 58.62,9.01 61.21,9.01 62.6,10.4 63.4,10.4 64,9.8 v64,9.7 v64,7.9 | 25.3,4.3 25.3,6.7 28.3,9.7 32.9,9.7 33.3,9.3 35,9.3 36.5,7.8 40.8,7.8 v40.9,7.7 | v83.21,6.4 83.13,6.4 82.36,7.17 82.36,9.49 81.7,10.15 v81.7,10.5 81.7,10.8 82.1,11.2 82.84,11.2 84.23,9.81 87.74,9.81 v88.23,9.33 | v68.5,4.9 70.1,4.9 72.1,2.9 v72.2,2.9 | v94.1,9.11 94.41,9.11 94.81,9.51 102.79,9.51 104.17,10.89 107.33,10.89 108.52,9.7 v111.3,9.7 | v125.86,20.97 125.86,19.11 v125.98,18.99 | v125.74,22.66 125.74,24.17 126.13,24.56 v126.13,26.8 | v121.47,28.78 121.1,28.4 v117.1,28.4 | v24,4.3 25.3,4.3
  Bottom 0.254: 26.65,28.2 34.3,28.2 34.61,28.51 34.61,30.47 35.03,30.9 JP1.2 | v16.4,2.8 R22.1 | v17.9,2.8 18.3,2.8 19.01,2.09 24.02,2.09 JP8.7 | v44.5,10.6 43.95,10.6 43,11.55 R7.1 | R28.1 43.85,1.6 42.9,1.6 40.8,3.7 40.8,7.6 v40.9,7.7 41.75,8.55 43.52,8.55 43.7,8.37 44.23,8.37 v44.5,8.1 | R4.1 26.65,28.2 | 26.65,28.2 25,28.2 21.52,31.68 14.1,31.68 13,30.58 v13,30.2 | 5.5,28.5 5.12,28.5 1.66,25.04 1.66,20.31 3.86,18.11 3.86,15.19 1.66,12.99 1.66,8.31 8.87,1.1 v10.3,1.1 | 5.5,28.5 R1.1 | v5.5,28.9 5.5,28.5 | R31.1 63.15,1.7 61.75,1.7 61.2,2.25 61.2,5.2 60.3,6.1 60.3,7.3 61.1,8.1 63.8,8.1 v64,7.9 65,6.9 65,5.9 66.29,4.61 68.21,4.61 v68.5,4.9 | R10.1 62.7,11.05 64,9.75 v64,9.7 | R13.1 v81.7,10.5 | v83.21,6.4 82.8,6.4 81.04,4.64 80.63,4.64 80.1,4.11 80.1,2.83 | R34.1 80.6,1.9 80.1,2.4 80.1,2.83 | v72.2,2.9 72.69,2.41 79.67,2.41 79.67,2.4 80.1,2.83 | R40.1 120.4,2.9 119.3,4 R37.1 118.95,6.02 119.14,6.21 119.14,6.67 120,7.53 120,8.61 119.51,9.11 | 119.51,9.11 119.51,11.4 121.51,13.4 123.9,13.4 124.98,14.48 124.98,16.08 125.88,16.99 125.88,18.89 v125.98,18.99 | v88.23,9.33 88.47,9.33 88.84,8.96 93.53,8.96 93.68,9.11 v94.1,9.11 | R16.1 v121.47,28.78 122.07,28.18 122.07,24.56 123.26,23.37 124.94,23.37 126.13,24.56 v126.13,26.8 126.13,27.98 R19.1 | v125.86,20.97 125.86,22.54 v125.74,22.66 | v111.3,9.7 112.99,8.01 118.41,8.01 119.51,9.11 | R25.1 24.75,4.3 v24,4.3 | R44.1 102.15,28.4 108.9,28.4 109,28.5 112.3,28.5 112.4,28.4 v117.1,28.4
N$1  (via drill 0.35)
  Top 0.254: LED1.1 8.02,29.73 v8,29.7
  Bottom 0.254: R1.2 8.3,28.5 8,28.8 v8,29.7
N$2  (via drill 0.35)
  Top 0.254: v8,30.7 9.17,30.7 LED1.2
  Bottom 0.254: R2.2 6.9,30.6 7,30.7 v8,30.7
N$3  (via drill 0.35)
  Top 0.254: v12.2,29.7 11.02,29.7 LED1.4
  Bottom 0.254: v12.2,29.7 12.2,28.8 11.95,28.55 11.9,28.55 R3.2
N$4  (via drill 0.35)
  Top 0.254: LED2.1 28.02,30.33 v28,30.3
  Bottom 0.254: v28,30.3 28,29.3 28.1,29.2 R4.2
N$5  (via drill 0.35)
  Top 0.254: v28,31.4 29.07,31.4 LED2.2
  Bottom 0.254: R5.2 v28,31.4
N$6  (via drill 0.35)
  Top 0.254: v32.2,30.3 31.02,30.3 LED2.4
  Bottom 0.254: v32.2,30.3 32.2,29.6 31.85,29.25 R6.2
N$7  (via drill 0.35)
  Top 0.254: LED3.1 47.5,30.03 46.8,29.33 46.8,27.92 45.57,26.69 45.57,23.53 46.09,23.01 46.09,20.99 43.79,18.69 43.79,17.89 43.26,17.36 43.26,16.53 42.8,16.07 v42.8,15.9
  Bottom 0.254: v42.8,15.9 43.1,15.6 43.1,13.55 R7.2
N$8  (via drill 0.35)
  Top 0.254: LED3.2 46.97,30.98 46.3,30.3 46.3,28 45.16,26.87 45.16,23.34 45.68,22.82 45.68,21.16 43.38,18.86 43.38,18.06 42.6,17.28 v42.6,16.9
  Bottom 0.254: v42.6,16.9 42.1,16.4 42.1,15.7 40.9,14.5 R8.2
N$9  (via drill 0.35)
  Top 0.254: LED3.4 49.8,29.73 49.8,29.28 48.66,28.13 47.59,28.13 45.98,26.52 45.98,23.72 46.49,23.21 46.49,20.82 44.19,18.52 44.19,17.69 43.7,17.2 43.7,16.6 44.2,16.1 v44.2,15.9
  Bottom 0.254: R9.2 44.85,13.45 44,14.3 44,15.7 v44.2,15.9
N$10  (via drill 0.35)
  Top 0.254: v64,14.9 64.4,15.3 64.4,28.43 65.7,29.73 LED4.1
  Bottom 0.254: R10.2 62.6,13.85 63.65,14.9 v64,14.9
N$11  (via drill 0.35)
  Top 0.254: v63.7,15.9 63.99,16.19 63.99,17.4 63.99,17.5 63.99,29.59 65.1,30.7 66.17,30.7 LED4.2
  Bottom 0.254: R11.2 61.65,13.9 62,13.9 63.7,15.6 v63.7,15.9
N$12  (via drill 0.35)
  Top 0.254: LED4.4 68.32,29.73 68.41,29.64 68.41,28.74 67.5,27.83 66.36,27.83 64.87,26.33 64.87,15.33 v65.3,14.9
  Bottom 0.254: R12.2 64.7,12.9 65.3,13.5 v65.3,14.9
N$13  (via drill 0.35)
  Top 0.254: LED5.1 82.42,30.03 82.09,29.69 82.09,23.41 83.21,22.29 85.88,22.29 88.16,20.01 88.16,12.39 86.97,11.21 85.13,11.21 82.73,13.6 82.2,13.6 81.7,14.1 v81.7,14.3
  Bottom 0.254: R13.2 v81.7,14.3
N$14  (via drill 0.35)
  Top 0.254: v82.61,14.3 85.3,11.61 86.8,11.61 87.75,12.56 87.75,19.84 85.71,21.88 83.04,21.88 81.68,23.24 81.68,29.88 82.8,31 84.67,31 LED5.2
  Bottom 0.254: R14.2 82.75,14.3 v82.61,14.3
N$15  (via drill 0.35)
  Top 0.254: LED5.4 86.67,30.03 87,29.7 87,29.6 86.6,29.2 84,29.2 82.49,27.69 82.49,23.61 83.41,22.69 86.11,22.69 88.56,20.24 88.56,12.22 87.14,10.8 84.96,10.8 82.57,13.19 81.71,13.19 80.79,14.11 v80.79,14.3
  Bottom 0.254: R15.2 80.65,14.3 v80.79,14.3
N$16  (via drill 0.35)
  Top 0.254: v117.1,31.4 116.8,31.4 116.31,31.89 108.19,31.89 105.9,29.6 103.1,29.6 102.8,29.9 102.8,30.23 102.9,30.33 LED6.1
  Bottom 0.254: R16.2 118.75,30.25 117.6,31.4 v117.1,31.4
N$17  (via drill 0.35)
  Top 0.254: LED6.2 103.07,31.4 102.1,31.4 101.8,31.1 101.8,30.2 102.81,29.19 106.09,29.19 107.89,30.99 109.81,30.99 112.6,28.2 115.3,28.2 117.1,30 v117.1,30.4
  Bottom 0.254: v117.1,30.4 117.1,29.8 118.75,28.15 R17.2
N$18  (via drill 0.35)
  Top 0.254: v117.1,32.4 117,32.3 108,32.3 105.9,30.2 105.12,30.2 LED6.4
  Bottom 0.254: R18.2 118.25,32.4 v117.1,32.4
N$19  (via drill 0.35)
  Top 0.254: LED7.1 122.02,29.73 v122,29.7
  Bottom 0.254: v122,29.7 123.4,28.3 R19.2
N$20  (via drill 0.35)
  Top 0.254: LED7.2 122.02,30.68 v122,30.7
  Bottom 0.254: v122,30.7 124.45,30.7 R20.2
N$21  (via drill 0.35)
  Top 0.254: LED7.4 127.92,29.73 v128.6,30.4
  Bottom 0.254: R21.2 128.55,30.35 v128.6,30.4
N$22  (via drill 0.35)
  Top 0.254: v9,4.4 10.17,4.4 LED8.1
  Bottom 0.254: R22.2 10.3,2.8 9,4.1 v9,4.4
N$23  (via drill 0.35)
  Top 0.254: v9,5.4 10.17,5.4 LED8.2
  Bottom 0.254: R23.2 14.35,1.1 11.3,1.1 8.3,4.1 8.3,4.7 v9,5.4
N$24  (via drill 0.35)
  Top 0.254: v13.2,4.4 12.02,4.4 LED8.4
  Bottom 0.254: v13.2,4.4 R24.2
N$25  (via drill 0.35)
  Top 0.254: LED9.1 28.1,2.13 26.87,2.13 v26.6,2.4
  Bottom 0.254: v26.6,2.4 26.95,2.75 R25.2
N$26  (via drill 0.35)
  Top 0.254: LED9.2 28.3,3.3 28.1,3.5 v28.1,4.2
  Bottom 0.254: v28.1,4.2 28.1,5.45 27.65,5.9 R26.2
N$27  (via drill 0.35)
  Top 0.254: v34.3,1.6 33.77,2.13 30.3,2.13 LED9.4
  Bottom 0.254: R27.2 34.3,2.85 v34.3,1.6
N$28  (via drill 0.35)
  Top 0.254: v47.1,1.1 LED10.1
  Bottom 0.254: R28.2 46.2,2 v47.1,1.1
N$29  (via drill 0.35)
  Top 0.254: LED10.2 v47.1,3.9
  Bottom 0.254: v47.1,3.9 46.9,4.1 R29.2
N$30  (via drill 0.35)
  Top 0.254: v48.9,1.1 LED10.4
  Bottom 0.254: R30.2 49.8,2 v48.9,1.1
N$31  (via drill 0.35)
  Top 0.254: v65,0.58 65.55,0.58 66.2,1.23 LED11.1
  Bottom 0.254: R31.2 65,1.85 v65,0.58
N$32  (via drill 0.35)
  Top 0.254: v66.2,3.3 LED11.2
  Bottom 0.254: R32.2 65.5,4 v66.2,3.3
N$33  (via drill 0.35)
  Top 0.254: v69.1,0.58 68.85,0.58 LED11.4
  Bottom 0.254: R33.2 69.15,0.63 v69.1,0.58
N$34  (via drill 0.35)
  Top 0.254: v85.3,1 LED12.1
  Bottom 0.254: R34.2 84.75,1 v85.3,1
N$35  (via drill 0.35)
  Top 0.254: v85.3,3.9 LED12.2
  Bottom 0.254: R35.2 85.2,4 v85.3,3.9
N$36  (via drill 0.35)
  Top 0.254: v87.1,1 LED12.4
  Bottom 0.254: R36.2 87.65,1 v87.1,1
N$37  (via drill 0.35)
  Top 0.254: v110.5,3.9 110,4.4 103.1,4.4 102.6,3.9 102.6,2.8 103.1,2.3 104.07,2.3 LED13.1
  Bottom 0.254: R37.2 117,4 116.31,3.31 112.59,3.31 112,3.9 v110.5,3.9
N$38  (via drill 0.35)
  Top 0.254: v111.1,3.2 110.1,3.2 109.31,3.99 103.89,3.99 103.6,3.7 103.6,3.5 103.82,3.28 LED13.2
  Bottom 0.254: R38.2 116.25,2.9 112.4,2.9 112.1,3.2 v111.1,3.2
N$39  (via drill 0.35)
  Top 0.254: v111.74,2.49 111.15,1.9 106.32,1.9 LED13.4
  Bottom 0.254: R39.2 112.75,1.9 112.16,2.49 v111.74,2.49
N$40  (via drill 0.35)
  Top 0.254: v121,4.4 121.02,4.43 LED14.1
  Bottom 0.254: R40.2 122.75,3.2 122.75,3.6 121.95,4.4 v121,4.4
N$41  (via drill 0.35)
  Top 0.254: LED14.2 121,5.38 v121,5.4
  Bottom 0.254: R41.2 121,5.75 v121,5.4
N$42  (via drill 0.35)
  Top 0.254: v125.2,4.4 124.02,4.4 LED14.4
  Bottom 0.254: R42.2 124.45,3.2 124.45,3.65 v125.2,4.4
N$43
  Bottom 0.254: D1.2 102.59,31.1 98.6,31.1 97.6,30.1 R43.2
N$44
  Bottom 0.254: R44.2 102.15,30.1 105.4,30.1 106.12,30.82 D1.6
N$45
  Bottom 0.203: 104.63,31.03 D1.4
  Bottom 0.254: R45.2 99.7,30.15 100.17,30.62 104.22,30.62 104.63,31.03
R  (via drill 0.35)
  Top 0.254: v23.1,3.5 22.9,3.5 22.9,1.94 JP8.8 | v27.8,27.5 28,27.7 28.6,27.7 29.1,28.2 32.6,28.2 33.4,29 v33.4,30.3 | v30.9,5.8 v34.2,5.8 34.67,5.8 36.17,7.3 40.2,7.3 40.84,6.66 40.84,3.63 44.13,0.34 51.54,0.34 51.65,0.45 | v46.1,10.6 v46.1,8.7 | v65,9.7 64.8,9.5 64.8,8.1 v65,7.9 65,6.2 64.2,5.4 60.95,5.4 58.72,7.63 55.73,7.63 52.3,4.2 52.3,1.1 51.65,0.45 | 82.9,5.7 81.95,6.65 81.95,9.22 80.79,10.38 v80.79,10.5 80.79,10.59 81.81,11.61 83.01,11.61 83.01,11.6 83.1,11.6 84.49,10.21 88.11,10.21 v88.2,10.3 | 82.9,5.7 v84.5,5.7 | v80.1,1.4 80.17,1.47 81.1,1.47 82,2.38 82,4.8 82.9,5.7 | v94.1,10.02 102.72,10.02 104,11.3 108,11.3 v108.1,11.4 | v128.5,18.5 v128.5,16.4 | v111.8,27.7 115.42,27.7 117.12,29.4 119.42,29.4 v121.52,31.5 | v115.5,0.8 113.8,0.8 112.5,2.1 112.5,3 v110.6,4.9 | v51.4,0.68 51.63,0.45 51.65,0.45
  Bottom 0.254: JP8.8 23.17,1.67 18.03,1.67 17.15,2.55 17.15,3.9 16.65,4.4 R24.1 | v23.1,3.5 22.8,3.2 19.5,3.2 17.73,4.97 17.73,5.32 16.66,6.39 16.47,6.39 | v27.8,27.5 27.6,27.7 24.8,27.7 23.7,28.8 13.8,28.8 13.55,28.55 R3.1 13.55,28.1 12.76,27.31 11.19,27.31 11,27.5 9.2,27.5 9,27.3 4.5,27.3 2.07,24.87 2.07,20.48 4.27,18.28 4.27,15.02 2.07,12.82 2.07,8.48 4.15,6.39 16.47,6.39 | v34.2,5.8 33.9,5.5 33.9,4.7 34.4,4.2 35.6,4.2 36.05,3.75 R27.1 | v30.9,5.8 31.23,6.13 31.23,10.44 30.61,11.06 24.16,11.06 21.7,8.6 18.7,8.6 16.5,6.4 16.47,6.4 16.47,6.39 | R9.1 45.1,11.35 45.85,10.6 v46.1,10.6 | v46.1,8.7 45.9,8.5 45.9,6.53 47.16,5.27 49.23,5.27 51.75,2.75 R30.1 51.4,1.65 v51.4,0.68 | v65,7.9 65.43,7.9 66.26,8.73 68.97,8.73 70.85,6.85 R33.1 70.95,2 79.5,2 v80.1,1.4 | R12.1 65,10.75 v65,9.7 | R15.1 79.6,11.45 80.55,10.5 v80.79,10.5 | v84.5,5.7 84.83,5.7 85.26,5.27 87.53,5.27 90.25,2.55 R36.1 | v88.2,10.3 89.1,9.4 93.36,9.4 93.98,10.02 v94.1,10.02 | R18.1 120.85,31.5 v121.52,31.5 121.54,31.52 128.98,31.52 130.25,30.25 R21.1 130.25,27.35 129.6,26.7 127.8,26.7 126.94,25.84 126.94,24.36 128.5,22.8 v128.5,18.5 | v128.5,16.4 126.5,14.4 126.5,12.9 126.8,12.6 126.8,3.6 126.45,3.25 R42.1 126.45,2.25 125.1,0.9 116.1,0.9 115.45,1.55 R39.1 115.45,0.85 v115.5,0.8 | v111.8,27.7 111.49,28.01 109.11,28.01 105.01,23.91 103.09,23.91 101.7,25.3 101.7,26.55 100.6,27.65 100.1,27.65 R45.1 | v110.6,4.9 109,4.9 108.8,5.1 108.8,8.51 108.1,9.21 v108.1,11.4 | R6.1 33.76,29.42 33.76,30.3 | 33.76,30.3 JP1.3 | v33.4,30.3 33.76,30.3
V  (via drill 0.35)
  Top 0.254: 11.1,30.68 LED1.3 | 12,5.4 LED8.3 | 88.86,6.34 88.97,6.44 | 88.51,5.99 87.1,4.58 LED12.3 | 105,31.4 LED6.3
  Top 0.508: JP1.1 36.3,31.41 36.07,31.18 31.12,31.18 31.02,31.28 | 11.1,30.68 12.17,30.68 v12.2,30.7 12.5,31 13.31,31 13.78,30.53 13.78,26.79 12.9,25.9 v12.7,25.9 | v12,7.1 12,5.4 | LED8.3 12.02,5.4 v13.2,5.4 | v24.1,32.1 24.7,32.7 30.5,32.7 31.92,31.28 31.02,31.28 | LED2.3 31.02,31.28 | LED9.3 30.9,4.08 v30.9,4.2 35.01,4.2 35.7,4.89 v35.7,5 | LED10.3 v48.9,3.9 v51.6,3.9 | LED11.3 v68,3.3 67.2,4.1 61.5,4.1 58.5,7.1 56,7.1 53,4.1 v53,3.9 | v48.1,10.6 v50,8.7 | v44.4,16.9 44.73,17.23 44.73,18.3 47.1,20.67 47.1,20.9 50.9,24.7 50.9,26.5 50.6,26.8 50.6,27.6 51.1,28.1 51.1,30.5 50.62,30.98 LED3.3 | v67.6,9.9 69.6,7.9 69.6,6.95 | 69.6,6.95 v69.6,6.9 | v73.2,3.9 73.2,4.3 72.58,4.92 71.63,4.92 69.6,6.95 | LED4.3 68.02,30.7 68.9,30.7 69.4,30.2 69.4,24.4 65.4,20.4 65.4,16.1 v65.6,15.9 | v77.8,3.5 79.1,2.2 79.1,1.05 79.7,0.45 80.95,0.45 84.1,3.6 84.1,4.4 84.5,4.8 87.1,4.8 | 88.51,5.99 87.32,4.8 87.1,4.8 | 88.51,5.99 88.86,6.34 | 87.1,4.8 LED12.3 | v88.7,5.8 88.51,5.99 | 88.97,6.44 89.1,6.58 89.1,20 89.1,20.46 | LED5.3 87.52,30.98 88.1,30.4 88.1,29.4 87.1,28.4 84.1,28.4 83.03,27.33 83.03,23.9 83.7,23.23 86.33,23.23 89.1,20.46 | 89.1,20.46 89.16,20.46 89.6,20.9 93,20.9 93.5,20.4 101.1,20.4 102.6,21.9 102.6,22.9 101.1,24.4 v101.1,32.12 101.22,32.25 104.83,32.25 104.89,32.19 105,32.08 105,31.4 | v96.54,7.9 96.9,7.9 99.7,5.1 v104.3,5.1 | LED13.3 105.96,3.34 v107.2,3.34 | v106.8,5.9 v110.3,5.9 | v118.4,6.4 v119.8,6.4 | LED14.3 124.73,6.11 v125.7,6.11 | LED7.3 125.72,31.4 129.1,31.4 130.3,30.2 130.3,29.2 126.9,25.8 v126.9,18
  Bottom 0.254: 2.6,12.6 2.6,12.4 | 103.6,32.37 105.1,32.37 105.31,32.16 D1.5 | D1.3 103.57,32.34 103.6,32.37 | v101.1,32.12 101.35,32.37 101.93,32.37 102.1,32.37 | 102.1,32.37 103.6,32.37 | D1.1 102.08,32.35 102.1,32.37
  Bottom 0.508: v24.1,32.1 24,32.1 23.89,32.21 13.88,32.21 12.66,30.99 12.49,30.99 v12.2,30.7 | v12.7,25.9 12.73,25.87 12.73,24.83 11.07,23.17 9.03,23.17 8.5,23.7 3.9,23.7 2.6,22.4 2.6,20.7 4.8,18.5 4.8,14.8 2.6,12.6 | 2.6,12.4 2.6,8.7 4.3,7 11.9,7 v12,7.1 | v13.2,5.4 13.4,5.6 16.7,5.6 17.2,5.1 17.2,4.7 19.25,2.65 24.35,2.65 25.2,1.8 25.9,1.8 26.58,1.12 JP8.6 26.58,1.08 27.26,1.76 27.76,1.76 30.2,4.2 v30.9,4.2 | v35.7,5 35.7,6.05 36.51,6.85 36.53,6.9 36.53,7.03 38.58,9.09 43.74,9.09 43.92,8.9 44.85,8.9 45.37,8.38 45.37,6.31 46.94,4.74 48.36,4.74 48.9,4.2 v48.9,3.9 | v53,3.9 v51.6,3.9 50.15,5.35 50.15,8.55 v50,8.7 | v48.1,10.6 46.25,12.45 46.25,15.05 v44.4,16.9 | v69.6,6.9 70.1,6.4 70.1,4.6 68.8,3.3 v68,3.3 | v67.6,9.9 69.1,11.4 69.1,13.4 66.6,15.9 v65.6,15.9 | v77.8,3.5 77.69,3.4 73.7,3.4 v73.2,3.9 | v88.7,5.8 92.41,5.8 93.96,7.35 95.99,7.35 v96.54,7.9 | v104.3,5.1 106,5.1 | 106,5.1 v106.8,5.9 | v107.2,3.34 106,4.54 106,5.1 | v110.3,5.9 112.7,5.9 113.3,6.5 118.3,6.5 v118.4,6.4 | v125.7,6.11 125.86,6.27 125.86,10.64 124.1,12.4 | 124.1,12.4 121.26,12.4 120.1,11.24 120.1,9.27 120.53,8.83 120.53,7.13 v119.8,6.4 | v126.9,18 126.51,17.62 126.51,16.77 125.56,15.82 125.56,13.86 124.1,12.4